# Altium schematic sheet LED_Panel.SchDoc
size A
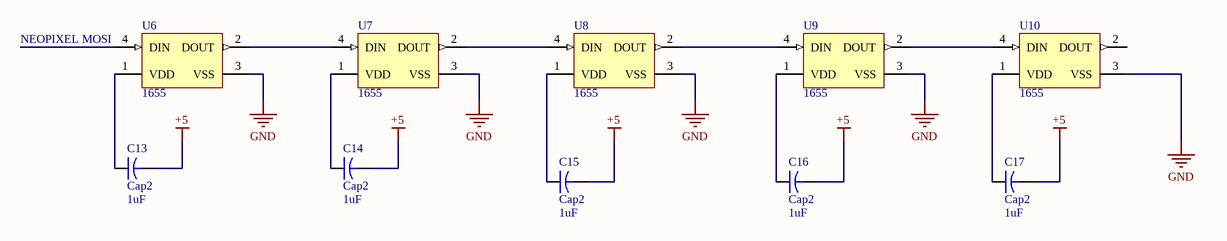
[diagram p0: LED_Panel.SchDoc]

## Parts
C13  Cap2  value 1uF  [C0805]
C14  Cap2  value 1uF  [C0805]
C15  Cap2  value 1uF  [C0805]
C16  Cap2  value 1uF  [C0805]
C17  Cap2  value 1uF  [C0805]
U6  1655  [ADA-RGB-1655_V]
U7  1655  [ADA-RGB-1655_V]
U8  1655  [ADA-RGB-1655_V]
U9  1655  [ADA-RGB-1655_V]
U10  1655  [ADA-RGB-1655_V]

## Nets
+5: C13.2 C14.2 C15.2 C16.2 C17.2
GND: U6.3(VSS) U7.3(VSS) U8.3(VSS) U9.3(VSS) U10.3(VSS)
NetC13_1: C13.1 U6.1(VDD)
NetC14_1: C14.1 U7.1(VDD)
NetC15_1: C15.1 U8.1(VDD)
NetC16_1: C16.1 U9.1(VDD)
NetC17_1: C17.1 U10.1(VDD)
NetU6_2: U6.2(DOUT) U7.4(DIN)
NetU7_2: U7.2(DOUT) U8.4(DIN)
NetU8_2: U8.2(DOUT) U9.4(DIN)
NetU9_2: U9.2(DOUT) U10.4(DIN)

Not connected (* = marked no-connect by the designer): U6 4(DIN); U10 2(DOUT)

## Notes on the sheet
- (near U6) NEOPIXEL MOSI

## Library data of the parts
C13-C17 = Cap2_1: Capacitor; Published: 23-Sep-2002; PackageReference: CAPR5-4X5; Publisher: Altium Limited; PackageDescription: Capacitor; 2 Leads
U6-U10 = CMP-2000-05026-1: Intelligent Control LED Integrated Light Source, 3.5 to 5.3 V, -25 to 80 degC, 4-Pin SMD, RoHS, Tape and Reel; Manufacturer: Adafruit-Industries-LLC; Number of LEDs: 10; Configuration: Discrete; Utilized LED: WS2812(5050); Datasheet URL: http://datasheet.octopart.com/ADA1655-Adafruit-Industries-datasheet-32028139.pdf; Series: Neopixel; Interface: -; Package Description: 4-Pin Surface Mount Device, Body 5 x 5 mm; Color: Red,Green,Blue(RGB); Category: Optoelectronics; Controller Type: -; Package Reference: 1655; Manufacturer URL: https://www.adafruit.com/; Mounting Type: SurfaceMount; Datasheet Version: May-13; Size / Dimension: 5.00mmLx5.00mmW; Family: Addressable,Specialty